# Altium schematic sheet 0084 - Power.SchDoc: 0084 - AR Display
size Tabloid; Date: 3/18/2018; DrawnBy: Ryan Young; DocumentNumber: 1; Revision: 2.1; SheetNumber: 1; SheetTotal: 3; SheetTitle: Power; PageSetup: Record=PageOptions|CenterHorizontal=True|CenterVertical=True|PrintScale=0.95|XCorrection=1.00|YCorrection=1.00|PrintKind=0|BorderSize=5000000|LeftOffset=0|BottomOffset=0|Orientation=2|PaperLength=1000|PaperWidth=1000|Scale=100|PaperSource=15|PrintQuality=600|MediaType=1|DitherType=10|PaperKind=Letter (8.5 x 11")|PrintScaleMode=1; Time: 3/18/2018
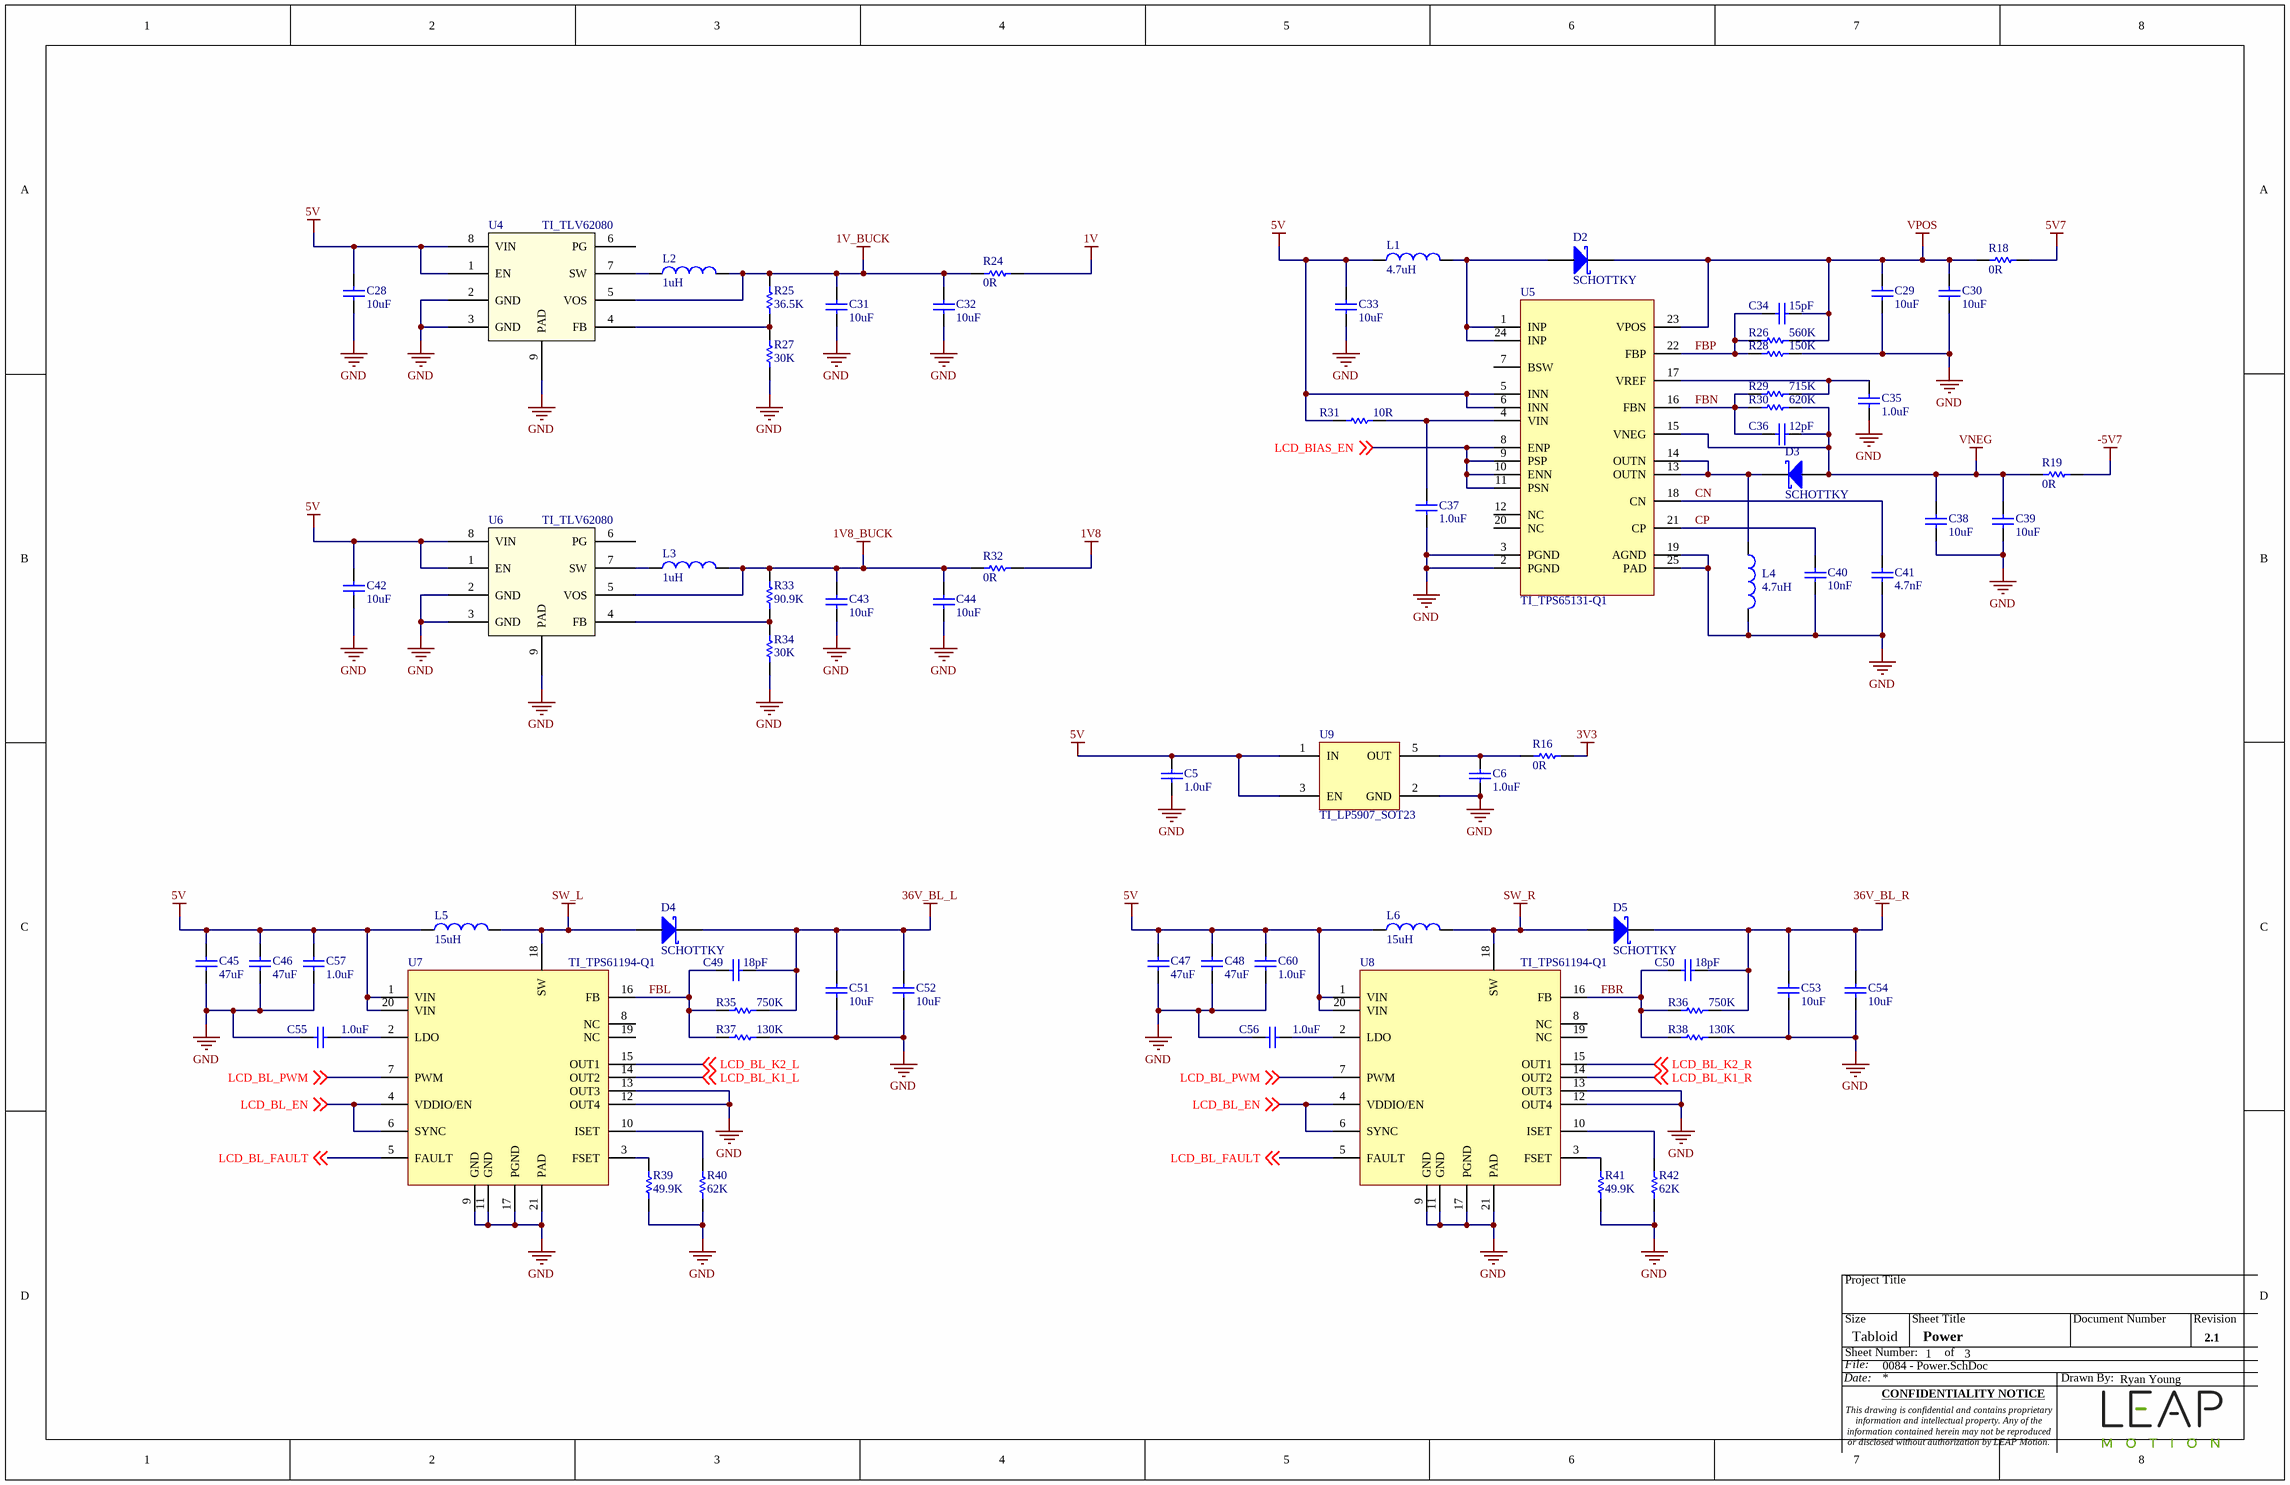
[diagram p0: 0084 - Power.SchDoc]

## Parts
C5  1.0uF  [CAPC0402(1005)60_N]
C6  1.0uF  [CAPC0402(1005)60_N]
C28  10uF  [CAPC0603(1608)100_N]
C29  10uF  [CAPC0603(1608)100_N]
C30  10uF  [CAPC0603(1608)100_N]
C31  10uF  [CAPC0603(1608)100_N]
C32  10uF  [CAPC0603(1608)100_N]
C33  10uF  [CAPC0603(1608)100_N]
C34  15pF  [CAPC0201(0603)33_N]
C35  1.0uF  [CAPC0402(1005)60_N]
C36  12pF  [CAPC0201(0603)33_N]
C37  1.0uF  [CAPC0402(1005)60_N]
C38  10uF  [CAPC0603(1608)100_N]
C39  10uF  [CAPC0603(1608)100_N]
C40  10nF  [CAPC0402(1005)60_N]
C41  4.7nF  [CAPC0402(1005)60_N]
C42  10uF  [CAPC0603(1608)100_N]
C43  10uF  [CAPC0603(1608)100_N]
C44  10uF  [CAPC0603(1608)100_N]
C45  47uF  [CAPC0805(2012)100_N]
C46  47uF  [CAPC0805(2012)100_N]
C47  47uF  [CAPC0805(2012)100_N]
C48  47uF  [CAPC0805(2012)100_N]
C49  18pF  [CAPC0201(0603)33_N]
C50  18pF  [CAPC0201(0603)33_N]
C51  10uF  [CAPC1206(3216)170_N]
C52  10uF  [CAPC1206(3216)170_N]
C53  10uF  [CAPC1206(3216)170_N]
C54  10uF  [CAPC1206(3216)170_N]
C55  1.0uF  [CAPC0402(1005)60_N]
C56  1.0uF  [CAPC0402(1005)60_N]
C57  1.0uF  [CAPC0402(1005)60_N]
C60  1.0uF  [CAPC0402(1005)60_N]
D2  SCHOTTKY  [Toshiba_CUS10S40,H3F]
D3  SCHOTTKY  [Toshiba_CUS10S40,H3F]
D4  SCHOTTKY  [Toshiba_CUS10S40,H3F]
D5  SCHOTTKY  [Toshiba_CUS10S40,H3F]
L1  4.7uH  [INDC2520X10N]
L2  1uH  [INDC2520X10N]
L3  1uH  [INDC2520X10N]
L4  4.7uH  [INDC2520X10N]
L5  15uH  [Coilcraft_XAL4040-153MEB]
L6  15uH  [Coilcraft_XAL4040-153MEB]
R16  0R  [RESC0402(1005)_N]
R18  0R  [RESC0402(1005)_N]
R19  0R  [RESC0402(1005)_N]
R24  0R  [RESC0402(1005)_N]
R25  36.5K  [RESC0201(0603)_N]
R26  560K  [RESC0201(0603)_N]
R27  30K  [RESC0201(0603)_N]
R28  150K  [RESC0201(0603)_N]
R29  715K  [RESC0201(0603)_N]
R30  620K  [RESC0201(0603)_N]
R31  10R  [RESC0402(1005)_N]
R32  0R  [RESC0402(1005)_N]
R33  90.9K  [RESC0201(0603)_N]
R34  30K  [RESC0201(0603)_N]
R35  750K  [RESC0201(0603)_N]
R36  750K  [RESC0201(0603)_N]
R37  130K  [RESC0201(0603)_N]
R38  130K  [RESC0201(0603)_N]
R39  49.9K  [RESC0201(0603)_N]
R40  62K  [RESC0201(0603)_N]
R41  49.9K  [RESC0201(0603)_N]
R42  62K  [RESC0201(0603)_N]
U4  TI_TLV62080  [TI_TLV62080]
U5  TI_TPS65131-Q1  [TI_TPS65131-Q1]
U6  TI_TLV62080  [TI_TLV62080]
U7  TI_TPS61194-Q1  [TI_TPS61194-Q1]
U8  TI_TPS61194-Q1  [TI_TPS61194-Q1]
U9  TI_LP5907_SOT23  [TI_LP5907_SOT23]

## Nets
1V: R24.2
1V8: R32.2
1V8_BUCK: C43.2 C44.2 L3.2 R32.1 R33.2 U6.5(VOS)
1V_BUCK: C31.2 C32.2 L2.2 R24.1 R25.2 U4.5(VOS)
3V3: R16.2
5V: C5.1 C28.2 C33.2 C42.2 C45.2 C46.2 C47.2 C48.2 C57.2 C60.2 L1.1 L5.1 L6.1 R31.1 U4.1(EN) U4.8(VIN) U5.5(INN) U5.6(INN) U6.1(EN) U6.8(VIN) U7.1(VIN) U7.20(VIN) U8.1(VIN) U8.20(VIN) U9.1(IN) U9.3(EN)
5V7: R18.2
36V_BL_L: C49.1 C51.2 C52.2 D4.K R35.1
36V_BL_R: C50.1 C53.2 C54.2 D5.K R36.1
-5V7: R19.2
GND: C5.2 C6.2 C28.1 C29.1 C30.1 C31.1 C32.1 C33.1 C35.2 C37.1 C38.1 C39.1 C40.2 C41.2 C42.1 C43.1 C44.1 C45.1 C46.1 C47.1 C48.1 C51.1 C52.1 C53.1 C54.1 C55.2 C56.2 C57.1 C60.1 L4.2 R27.1 R28.1 R34.1 R37.1 R38.1 R39.1 R40.1 R41.1 R42.1 U4.2(GND) U4.3(GND) U4.9(PAD) U5.2(PGND) U5.3(PGND) U5.19(AGND) U5.25(PAD) U6.2(GND) U6.3(GND) U6.9(PAD) U7.9(GND) U7.11(GND) U7.12(OUT4) U7.13(OUT3) U7.17(PGND) U7.21(PAD) U8.9(GND) U8.11(GND) U8.12(OUT4) U8.13(OUT3) U8.17(PGND) U8.21(PAD) U9.2(GND)
SW_L: D4.A L5.2 U7.18(SW)
SW_R: D5.A L6.2 U8.18(SW)
VNEG: C36.1 C38.2 C39.2 D3.A R19.1 R30.1 U5.15(VNEG)
VPOS: C29.2 C30.2 C34.1 D2.K R18.1 R26.1 U5.23(VPOS)
CN: C41.1 U5.18(CN)
CP: C40.1 U5.21(CP)
FBL: C49.2 R35.2 R37.2 U7.16(FB)
FBN: C36.2 R29.2 R30.2 U5.16(FBN)
FBP: C34.2 R26.2 R28.2 U5.22(FBP)
FBR: C50.2 R36.2 R38.2 U8.16(FB)
LCD_BIAS_EN: U5.8(ENP) U5.9(PSP) U5.10(ENN) U5.11(PSN) ; off-sheet LCD_BIAS_EN
LCD_BL_EN: U7.4(VDDIO/EN) U7.6(SYNC) U8.4(VDDIO/EN) U8.6(SYNC) ; off-sheet LCD_BL_EN
LCD_BL_FAULT: U7.5(FAULT) U8.5(FAULT) ; off-sheet LCD_BL_FAULT
LCD_BL_K1_L: U7.14(OUT2) ; off-sheet LCD_BL_K1_L
LCD_BL_K1_R: U8.14(OUT2) ; off-sheet LCD_BL_K1_R
LCD_BL_K2_L: U7.15(OUT1) ; off-sheet LCD_BL_K2_L
LCD_BL_K2_R: U8.15(OUT1) ; off-sheet LCD_BL_K2_R
LCD_BL_PWM: U7.7(PWM) U8.7(PWM) ; off-sheet LCD_BL_PWM
NetC6_1: C6.1 R16.1 U9.5(OUT)
NetC35_1: C35.1 R29.1 U5.17(VREF)
NetC37_2: C37.2 R31.2 U5.4(VIN)
NetC55_1: C55.1 U7.2(LDO)
NetC56_1: C56.1 U8.2(LDO)
NetD2_A: D2.A L1.2 U5.1(INP) U5.24(INP)
NetD3_K: D3.K L4.1 U5.13(OUTN) U5.14(OUTN)
NetL2_1: L2.1 U4.7(SW)
NetL3_1: L3.1 U6.7(SW)
NetR25_1: R25.1 R27.2 U4.4(FB)
NetR33_1: R33.1 R34.2 U6.4(FB)
NetR39_2: R39.2 U7.3(FSET)
NetR40_2: R40.2 U7.10(ISET)
NetR41_2: R41.2 U8.3(FSET)
NetR42_2: R42.2 U8.10(ISET)

Not connected (* = marked no-connect by the designer): U4 6(PG); U5 7(BSW) 12(NC) 20(NC); U6 6(PG); U7 8(NC) 19(NC); U8 8(NC) 19(NC); U9 4(NC)

## Notes on the sheet
- Project Title
- Size
- Sheet Number:
- File:
- Tabloid
- Sheet Title
- of
- Document Number
- Revision
- Date:
- CONFIDENTIALITY NOTICE
- Drawn By:
- This drawing is confidential and contains proprietary information and intellectual property. Any of the information contained herein may not be reproduced or disclosed without authorization by LEAP Motion.

## Library data of the parts
C5 C6 C35 C37 C40 C41 C55-C57 C60 = CAP_0023: Capacitor, 1.0uF, 10V, 10%, 0402, Ceramic, X5R; Manufacturer: TDK; Manufacturer P/N: C1005X5R1A105K050BB; Polarity: No; Temp Range: -55C - 85C; P/N: CAP_0023; Display: 1.0uF, 10V; Value: 1.0uF; Tolerance: 10%; Voltage Rating: 10V; Dielectric: X5R; Material: Ceramic; Package: 0402; Max Height: 0.55mm; RoHS: True; Supplier: Digikey; Supplier P/N: 445-4114-6-ND; Supplier Price: 0.1; Datasheet: http://product.tdk.com/capacitor/mlcc/en/documents/mlcc_commercial_general_en.pdf; Date: 8/28/2013; Author: NR
C28-C33 C38 C39 C42-C44 = CAP_0069: Capacitor, 10uF, 10V, 10%, 0603, Ceramic, X5R; Manufacturer: Murata; Manufacturer P/N: GRM188R61A106KE69D; Polarity: No; Temp Range: -55C - 85C; P/N: CAP_0069; Display: 10uF, 10V; Value: 10uF; Tolerance: 10%; Voltage Rating: 10V; Dielectric: X5R; Material: Ceramic; Package: 0603; Max Height: 0.95mm; RoHS: True; Supplier: Digikey; Supplier P/N: 490-10474-1-ND; Supplier Price: 0.21; Datasheet: http://search.murata.co.jp/Ceramy/image/img/A01X/G101/ENG/GRM188R61A106KE69-01.pdf; Date: 7/19/2017; Author: RY
C34 = CAP_0067: Capacitor, 15pF, 50V, 2%, 0201, Ceramic, C0G(NP0); Manufacturer: Murata; Manufacturer P/N: GRM0335C1H150GA01D; Polarity: No; Temp Range: -55C - 125C; P/N: CAP_0067; Display: 15pF, 50V; Value: 15pF; Tolerance: 2%; Voltage Rating: 50V; Dielectric: C0G(NP0); Material: Ceramic; Package: 0201; Max Height: 0.15mm; RoHS: True; Supplier: Digikey; Supplier P/N: 490-11309-1-ND; Supplier Price: 0.1; Datasheet: http://search.murata.co.jp/Ceramy/image/img/A01X/G101/ENG/GRM0335C1H6R0BA01-01.pdf; Date: 7/19/2017; Author: RY
C36 = CAP_0065: Capacitor, 12pF, 50V, 2%, 0201, Ceramic, C0G(NP0); Manufacturer: Murata; Manufacturer P/N: GRM0335C1H120GA01D; Polarity: No; Temp Range: -55C - 125C; P/N: CAP_0065; Display: 12pF, 50V; Value: 12pF; Tolerance: 2%; Voltage Rating: 50V; Dielectric: C0G(NP0); Material: Ceramic; Package: 0201; Max Height: 0.15mm; RoHS: True; Supplier: Digikey; Supplier P/N: 490-11308-1-ND; Supplier Price: 0.1; Datasheet: http://search.murata.co.jp/Ceramy/image/img/A01X/G101/ENG/GRM0335C1H6R0BA01-01.pdf; Date: 7/19/2017; Author: RY
C45-C48 = CAP_0050: Capacitor, 47uF, 10V, 20%, 0805, Ceramic, X5R; Manufacturer: Murata; Manufacturer P/N: GRM21BR61A476ME15L; Polarity: No; Temp Range: -55C-125C; P/N: CAP_0050; Display: 47uF, 10V; Value: 47uF; Tolerance: 20%; Voltage Rating: 10V; Dielectric: X5R; Material: Ceramic; Package: 0805; Max Height: 1.25mm; RoHS: True; Supplier: Mouser; Supplier P/N: 81-GRM21BR61A476ME15L; Supplier Price: 0.84; Datasheet: http://www.mouser.com/ds/2/281/c02e-2905.pdf; Date: 8/25/2015; Author: JDS
C49 C50 = CAP_0066: Capacitor, 18pF, 50V, 2%, 0201, Ceramic, C0G(NP0); Manufacturer: Murata; Manufacturer P/N: GRM0335C1H180GA01D; Polarity: No; Temp Range: -55C - 125C; P/N: CAP_0066; Display: 18pF, 50V; Value: 18pF; Tolerance: 2%; Voltage Rating: 50V; Dielectric: C0G(NP0); Material: Ceramic; Package: 0201; Max Height: 0.15mm; RoHS: True; Supplier: Digikey; Supplier P/N: 490-11310-1-ND; Supplier Price: 0.1; Datasheet: http://search.murata.co.jp/Ceramy/image/img/A01X/G101/ENG/GRM0335C1H6R0BA01-01.pdf; Date: 7/19/2017; Author: RY
C51-C54 = CAP_0068: Capacitor, 10uF, 50V, 10%, 1206, Ceramic, X7R; Manufacturer: Samsung; Manufacturer P/N: CL31B106KBHNNNE; Polarity: No; Temp Range: -55C - 125C; P/N: CAP_0068; Display: 10uF, 50V; Value: 10uF; Tolerance: 10%; Voltage Rating: 50V; Dielectric: X7R; Material: Ceramic; Package: 1206; Max Height: 1.8mm; RoHS: True; Supplier: Digikey; Supplier P/N: 1276-6767-1-ND; Supplier Price: 0.33; Datasheet: https://media.digikey.com/pdf/Data%20Sheets/Samsung%20PDFs/CL_Series_MLCC_ds.pdf; Date: 7/19/2017; Author: RY
D2-D5 = DIODE_0020: Diode, -40C - 150C, SOD-323; Manufacturer: Toshiba; Manufacturer P/N: CUS10S40,H3F; P/N: DIODE_0020; Display: Diode; Package: SOD-323; Temp Range: -40C - 150C; RoHS: True; Supplier: Mouser; Supplier P/N: 757-CUS10S40H3F; Supplier Price: 0.42; Date: 3/18/2018
L1 L4 = IND_0023: FIXED IND 4.7UH 1.4A 216 MOHM; Manufacturer: Murata; Manufacturer P/N: DFE252012R-H-4R7M=P2; Tolerance: 20%; Shielding: Shielded; P/N: IND_0023; Value: 4.7uH; Current Rating: 1.4A; DCR: 216mOhm; Package: 1008; Operating Temp Range: -40C - 85C; Supplier: Digikey; Supplier P/N: 490-10658-1-ND; Supplier Price: 0.48; Datasheet: http://www.murata.com/~/media/webrenewal/products/inductor/chip/tokoproducts/wirewoundmetalalloychiptype/m_dfe252012r.ashx; Date: 7/20/2017; Author: RY
L2 L3 = IND_0001: INDUCTOR 1.0UH 20% 1600MA 1008; Manufacturer: Murata; Manufacturer P/N: LQM2HPN1R0MG0L; Current Rating: 1.6A; Shielding: Shielded; DCR: 68.75mOhm; P/N: IND_0001; Value: 1uH; Tolerance: 20%; Package: 1008; Operating Temp Range: -55C - 125C; Supplier: Digikey; Supplier P/N: 490-5112-1-ND; Supplier Price: 0.34; Datasheet: http://search.murata.co.jp/Ceramy/image/img/PDF/ENG/L0075S0104LQM2HP_G0.pdf; Date: 2/26/2013; Author: NR
L5 L6 = IND_0026: Fixed Inductors XAL4040 AEC-Q200 15 uH 20 % 2.8 A; Manufacturer: Coilcraft; Manufacturer P/N: XAL4040-153MEB; Current Rating: 2.8A; Tolerance: 20%; Shielding: Shielded; DCR: 120mOhm; P/N: IND_0026; Value: 15uH; Package: 4.3x4.3mm; Operating Temp Range: -40C - 125C; Supplier: Mouser; Supplier P/N: 994-XAL4040-153MEB; Supplier Price: 2.19; Datasheet: https://www.mouser.com/ds/2/597/xal4000-270751.pdf; Date: 3/18/2018; Author: RY
R16 R18 R19 R24 R32 = RES_0006: Resistor, 0R, 1/10W, Jumper, 0402; Manufacturer: Panasonic Electronic Components; Manufacturer P/N: ERJ-2GE0R00X; Display Value: 0R, 0402; Temp Range: -55C - 155C; P/N: RES_0006; Value: 0R; Tolerance: Jumper; Power Rating: 1/10W; Package: 0402; Max Height: 0.40mm; RoHS: True; Supplier: Digikey; Supplier P/N: P0.0JCT-ND; Supplier Price: 0.05; Datasheet: http://industrial.panasonic.com/www-data/pdf/AOA0000/AOA0000CE1.pdf; Date: 2/21/2013; Author: NR
R25 = RES_0176: Resistor, 36.5K, 1/20W, 1%, 0201; Manufacturer: Panasonic Electronic Components; Manufacturer P/N: ERJ-1GEF3652C; Display Value: 36.5K, 0201; Temp Range: -55C - 125C; P/N: RES_0176; Value: 36.5K; Tolerance: 1%; Power Rating: 1/20W; Package: 0201; Max Height: 0.26mm; RoHS: True; Supplier: Digikey; Supplier P/N: P36.5KABCT-ND; Supplier Price: 0.1; Datasheet: https://media.digikey.com/pdf/Data%20Sheets/Panasonic%20Resistors%20Thermistors%20PDFs/ERJ_G,R,E_Rev08.pdf; Date: 7/20/2017; Author: RY
R26 = RES_0194: Resistor, 560K, 1/20W, 1%, 0201; Manufacturer: Yageo; Manufacturer P/N: RC0201FR-07560KL; Display Value: 560K, 0201; Temp Range: -55C - 125C; P/N: RES_0194; Value: 560K; Tolerance: 1%; Power Rating: 1/20W; Package: 0201; Max Height: 0.26mm; RoHS: True; Supplier: Digikey; Supplier P/N: YAG2728CT-ND; Supplier Price: 0.1; Datasheet: https://www.mouser.com/ds/2/447/RC0201-559633.pdf; Date: 3/18/2018; Author: Ry
R27 R34 = RES_0175: Resistor, 30K, 1/20W, 1%, 0201; Manufacturer: Panasonic Electronic Components; Manufacturer P/N: ERJ-1GEF3002C; Display Value: 30K, 0201; Temp Range: -55C - 125C; P/N: RES_0175; Value: 30K; Tolerance: 1%; Power Rating: 1/20W; Package: 0201; Max Height: 0.26mm; RoHS: True; Supplier: Digikey; Supplier P/N: P30.0KABCT-ND; Supplier Price: 0.1; Datasheet: https://media.digikey.com/pdf/Data%20Sheets/Panasonic%20Resistors%20Thermistors%20PDFs/ERJ_G,R,E_Rev08.pdf; Date: 7/20/2017; Author: RY
R28 = RES_0173: Resistor, 150K, 1/20W, 1%, 0201; Manufacturer: Panasonic Electronic Components; Manufacturer P/N: ERJ-1GEF1503C; Display Value: 150K, 0201; Temp Range: -55C - 125C; P/N: RES_0173; Value: 150K; Tolerance: 1%; Power Rating: 1/20W; Package: 0201; Max Height: 0.26mm; RoHS: True; Supplier: Digikey; Supplier P/N: P150KABCT-ND; Supplier Price: 0.1; Datasheet: https://media.digikey.com/pdf/Data%20Sheets/Panasonic%20Resistors%20Thermistors%20PDFs/ERJ_G,R,E_Rev08.pdf; Date: 7/20/2017; Author: RY
R29 = RES_0195: Resistor, 715K, 1/20W, 1%, 0201; Manufacturer: Yageo; Manufacturer P/N: RC0201FR-07715KL; Display Value: 715K, 0201; Temp Range: -55C - 125C; P/N: RES_0195; Value: 715K; Tolerance: 1%; Power Rating: 1/20W; Package: 0201; Max Height: 0.26mm; RoHS: True; Supplier: Digikey; Supplier P/N: YAG2785CT-ND; Supplier Price: 0.1; Datasheet: https://www.mouser.com/ds/2/447/RC0201-559633.pdf; Date: 3/18/2018; Author: RY
R30 = RES_0174: Resistor, 620K, 1/20W, 1%, 0201; Manufacturer: Panasonic Electronic Components; Manufacturer P/N: ERJ-1GEF6203C; Display Value: 620K, 0201; Temp Range: -55C - 125C; P/N: RES_0174; Value: 620K; Tolerance: 1%; Power Rating: 1/20W; Package: 0201; Max Height: 0.26mm; RoHS: True; Supplier: Digikey; Supplier P/N: P620KABCT-ND; Supplier Price: 0.1; Datasheet: https://media.digikey.com/pdf/Data%20Sheets/Panasonic%20Resistors%20Thermistors%20PDFs/ERJ_G,R,E_Rev08.pdf; Date: 7/20/2017; Author: RY
R31 = RES_0094: Resistor, 10R, 1/10W, 1%, 0402; Manufacturer: Panasonic; Manufacturer P/N: ERJ-2RKF10R0X; Display Value: 10R, 0402; Temp Range: -55C - 155C; P/N: RES_0094; Value: 10R; Tolerance: 1%; Power Rating: 1/10W; Package: 0402; Max Height: 0.35mm; RoHS: True; Supplier: Mouser; Supplier P/N: 667-ERJ-2RKF10R0X; Supplier Price: 0.08; Date: 11/21/2013; Author: JDS
R33 = RES_0177: Resistor, 90.9K, 1/20W, 1%, 0201; Manufacturer: Panasonic Electronic Components; Manufacturer P/N: ERJ-1GEF9092C; Display Value: 90.9K, 0201; Temp Range: -55C - 125C; P/N: RES_0177; Value: 90.9K; Tolerance: 1%; Power Rating: 1/20W; Package: 0201; Max Height: 0.26mm; RoHS: True; Supplier: Digikey; Supplier P/N: P90.9KABCT-ND; Supplier Price: 0.1; Datasheet: https://media.digikey.com/pdf/Data%20Sheets/Panasonic%20Resistors%20Thermistors%20PDFs/ERJ_G,R,E_Rev08.pdf; Date: 7/20/2017; Author: RY
R35 R36 = RES_0169: Resistor, 750K, 1/20W, 1%, 0201; Manufacturer: Panasonic Electronic Components; Manufacturer P/N: ERJ-1GEF7503C; Display Value: 750K, 0201; Temp Range: -55C - 125C; P/N: RES_0169; Value: 750K; Tolerance: 1%; Power Rating: 1/20W; Package: 0201; Max Height: 0.26mm; RoHS: True; Supplier: Digikey; Supplier P/N: P750KABCT-ND; Supplier Price: 0.1; Datasheet: https://media.digikey.com/pdf/Data%20Sheets/Panasonic%20Resistors%20Thermistors%20PDFs/ERJ_G,R,E_Rev08.pdf; Date: 7/20/2017; Author: RY
R37 R38 = RES_0170: Resistor, 130K, 1/20W, 1%, 0201; Manufacturer: Panasonic Electronic Components; Manufacturer P/N: ERJ-1GEF1303C; Display Value: 130K, 0201; Temp Range: -55C - 125C; P/N: RES_0170; Value: 130K; Tolerance: 1%; Power Rating: 1/20W; Package: 0201; Max Height: 0.26mm; RoHS: True; Supplier: Digikey; Supplier P/N: P130KABCT-ND; Supplier Price: 0.1; Datasheet: https://media.digikey.com/pdf/Data%20Sheets/Panasonic%20Resistors%20Thermistors%20PDFs/ERJ_G,R,E_Rev08.pdf; Date: 7/20/2017; Author: RY
R39 R41 = RES_0067: Resistor, 49.9K, 1/20W, 1%, 0201; Manufacturer: Panasonic Electronic Components; Manufacturer P/N: ERJ-1GEF4992C; Display Value: 49.9K, 0201; Temp Range: -55C - 125C; P/N: RES_0067; Value: 49.9K; Tolerance: 1%; Power Rating: 1/20W; Package: 0201; Max Height: 0.26mm; RoHS: True; Supplier: Digikey; Supplier P/N: P49.9KABCT-ND; Supplier Price: 0.11; Date: 8/22/2013; Author: JDS
R40 R42 = RES_0071: Resistor, 62K, 1/20W, 1%, 0201; Manufacturer: Panasonic Electronic Components; Manufacturer P/N: P62.0KABDKR-ND; Display Value: 62K, 0201; Temp Range: -55C - 125C; P/N: RES_0071; Value: 62K; Tolerance: 1%; Power Rating: 1/20W; Package: 0201; Max Height: 0.26mm; RoHS: True; Supplier: Digikey; Supplier P/N: P62.0KABDKR-ND; Supplier Price: 0.11; Datasheet: http://media.digikey.com/pdf/Data%20Sheets/Panasonic%20Resistors%20Thermistors%20PDFs/ERJ_G,R,E_Rev08.pdf; Date: 8/28/2013; Author: NR
U4 U6 = IC_0195: IC REG BUCK ADJ 1.2A SYNC 8WSON; Manufacturer: TI; P/N: IC_0195; Manufacturer P/N: TLV62080; Package: WSON8; Operating Temp Range: -40C - 85C; Supplier: Digikey; Supplier P/N: 296-39270-1-ND; Supplier Price: 1.38; Datasheet: http://www.ti.com/lit/gpn/tlv62080; Date: 7/13/2017; Author: RY
U5 = IC_0199: IC REG BCK BST INV ADJ DL 24VQFN; Manufacturer: TI; P/N: IC_0199; Manufacturer P/N: TPS65131-Q1; Package: VQFN-24; Operating Temp Range: -40C - 105C; Supplier: Digikey; Supplier P/N: 296-40865-1-ND; Supplier Price: 3.43; Datasheet: http://www.ti.com/lit/ds/symlink/tps65131-q1.pdf; Date: 7/13/2017; Author: RY
U7 U8 = IC_0200: IC LED DRIVER 20TSSOP; Manufacturer: TI; P/N: IC_0200; Manufacturer P/N: TPS61194-Q1; Package: HTSSOP-20; Operating Temp Range: -40C - 105C; Supplier: Digikey; Supplier P/N: 296-43817-1-ND; Supplier Price: 4.35; Datasheet: http://www.ti.com/lit/ds/symlink/tps61194-q1.pdf; Date: 7/13/2017; Author: RY
U9 = IC_0118: 3.3 V LDO Voltage Regulators 250mA Ultra-Lo Noise LDO Reg; Manufacturer: TI; Manufacturer P/N: LP5907MFX-3.3NPB; P/N: IC_0118; Package: SOT23-5; Operating Temp Range: -40 - 125C; Supplier: Mouser; Supplier P/N: 595-LP5907MFX-3.3NPB; Supplier Price: 0.61; Datasheet: http://www.mouser.com/ds/2/405/snvs798h-522433.pdf; Date: 2/9/2015; Author: JDS